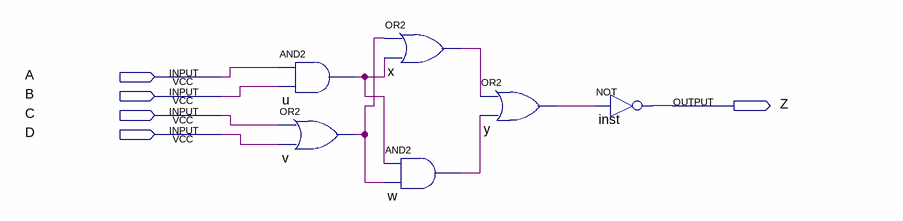
[diagram p0: schematic sheet]
// Quartus schematic Exercise11.bdf as structural Verilog: 6 symbols, 5 pins
module Exercise11 (
  input  A,
  input  B,
  input  C,
  input  D,
  output Z
);

  wire u_out, v_out, w_out, x_out, y_out;

  and u (u_out, A, B);
  or v (v_out, C, D);
  or x (x_out, v_out, u_out);
  and w (w_out, u_out, v_out);
  or y (y_out, x_out, w_out);
  not inst (Z, y_out);
endmodule
